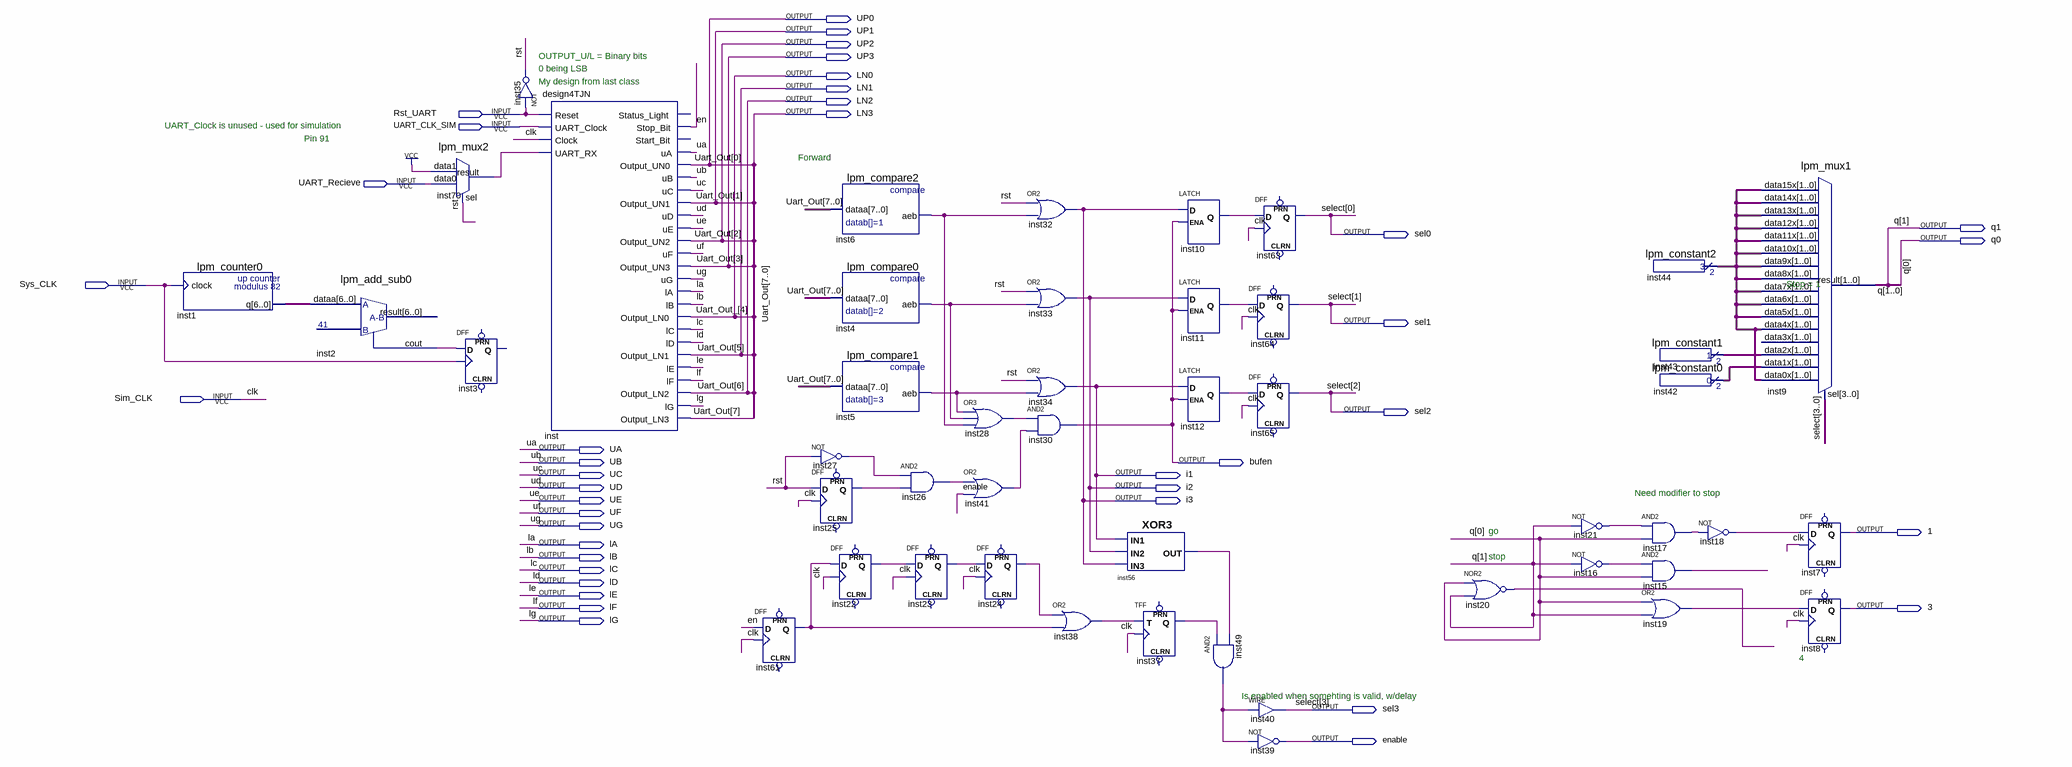
[diagram p0: schematic sheet]
// Quartus schematic project5.bdf as structural Verilog: 47 symbols, 40 pins
module project5 (
  input  Rst_UART,
  input  UART_CLK_SIM,
  input  UART_Recieve,
  input  Sys_CLK,
  input  Sim_CLK,
  output UP0,
  output UP1,
  output UP2,
  output UP3,
  output LN0,
  output LN1,
  output LN2,
  output LN3,
  output q1,
  output sel0,
  output q0,
  output sel1,
  output sel2,
  output UA,
  output UB,
  output bufen,
  output UC,
  output i1,
  output UD,
  output i2,
  output UE,
  output i3,
  output UF,
  output UG,
  output \1 ,
  output lA,
  output lB,
  output lC,
  output lD,
  output lE,
  output lF,
  output \3 ,
  output lG,
  output sel3,
  output enable
);

  wire en, inst2_cout, inst4_aeb, inst5_aeb, inst6_aeb, inst10_q, inst11_q, inst12_q, inst15_out, inst16_out,
       inst17_out, inst18_out, inst19_out, inst20_out, inst21_out, inst22_q, inst23_q, inst24_q, inst25_q,
       inst26_out, inst27_out, inst28_out, inst37_q, inst38_out, inst41_out, inst49_out, inst56_out,
       inst61_q, inst70_result, rst;
  wire [1:0] inst42_result, inst43_result, inst44_result;
  wire [6:0] inst1_q;
  wire [7:4] Uart_Out;

  lpm_counter0 inst1 (.clock(Sys_CLK), .q(inst1_q));
  lpm_add_sub0 inst2 (.dataa(inst1_q), .cout(inst2_cout));  // open: result
  lpm_mux2 inst70 (.data1(1'b1), .data0(UART_Recieve), .sel(rst), .result(inst70_result));
  DFF inst3 (.CLK(Sys_CLK), .D(inst2_cout));  // open: CLRN, PRN, Q
  not inst35 (rst, Rst_UART);
  design4TJN inst (
    .Reset(Rst_UART), .UART_Clock(UART_CLK_SIM), .Clock(Sim_CLK), .UART_RX(inst70_result), .Stop_Bit(en),
    .uA(UA), .Output_UN0(UP0), .uB(UB), .uC(UC), .Output_UN1(UP1), .uD(UD), .uE(UE), .Output_UN2(UP2),
    .uF(UF), .Output_UN3(UP3), .uG(UG), .lA(lA), .lB(lB), .Output_LN0(LN0), .lC(lC), .lD(lD),
    .Output_LN1(LN1), .lE(lE), .lF(lF), .Output_LN2(LN2), .lG(lG), .Output_LN3(Uart_Out[7]));  // open: Status_Light, Start_Bit
  DFF inst61 (.CLK(Sim_CLK), .D(en), .Q(inst61_q));  // open: CLRN, PRN
  not inst27 (inst27_out, rst);
  DFF inst25 (.CLK(Sim_CLK), .D(rst), .Q(inst25_q));  // open: CLRN, PRN
  lpm_compare2 inst6 (.dataa({Uart_Out[7], LN2, LN1, Uart_Out[4], UP3, UP2, UP1, UP0}), .aeb(inst6_aeb));
  lpm_compare0 inst4 (.dataa({Uart_Out[7], LN2, LN1, Uart_Out[4], UP3, UP2, UP1, UP0}), .aeb(inst4_aeb));
  lpm_compare1 inst5 (.dataa({Uart_Out[7], LN2, LN1, Uart_Out[4], UP3, UP2, UP1, UP0}), .aeb(inst5_aeb));
  DFF inst22 (.CLK(Sim_CLK), .D(inst61_q), .Q(inst22_q));  // open: CLRN, PRN
  and inst26 (inst26_out, inst27_out, inst25_q);
  DFF inst23 (.CLK(Sim_CLK), .D(inst22_q), .Q(inst23_q));  // open: CLRN, PRN
  or inst28 (inst28_out, inst5_aeb, inst4_aeb, inst6_aeb);
  or inst41 (inst41_out, inst26_out, enable);
  DFF inst24 (.CLK(Sim_CLK), .D(inst23_q), .Q(inst24_q));  // open: CLRN, PRN
  or inst32 (i3, rst, inst6_aeb);
  or inst33 (i2, rst, inst4_aeb);
  or inst34 (i1, rst, inst5_aeb);
  and inst30 (bufen, inst28_out, inst41_out);
  or inst38 (inst38_out, inst24_q, inst61_q);
  XOR3 inst56 (.IN3(i3), .IN1(i1), .IN2(i2), .OUT(inst56_out));
  TFF inst37 (.T(inst38_out), .CLK(Sim_CLK), .Q(inst37_q));  // open: PRN, CLRN
  LATCH inst10 (.D(i3), .ENA(bufen), .Q(inst10_q));
  LATCH inst11 (.D(i2), .ENA(bufen), .Q(inst11_q));
  LATCH inst12 (.D(i1), .ENA(bufen), .Q(inst12_q));
  and inst49 (inst49_out, inst37_q, inst56_out);
  DFF inst63 (.CLK(Sim_CLK), .D(inst10_q), .Q(sel0));  // open: CLRN, PRN
  DFF inst64 (.CLK(Sim_CLK), .D(inst11_q), .Q(sel1));  // open: CLRN, PRN
  DFF inst65 (.CLK(Sim_CLK), .D(inst12_q), .Q(sel2));  // open: CLRN, PRN
  assign sel3 = inst49_out;  // WIRE inst40
  not inst39 (enable, inst49_out);
  nor inst20 (inst20_out, q0, q1);
  not inst21 (inst21_out, q1);
  not inst16 (inst16_out, q1);
  lpm_constant2 inst44 (.result(inst44_result));
  lpm_constant1 inst43 (.result(inst43_result));
  lpm_constant0 inst42 (.result(inst42_result));
  and inst17 (inst17_out, inst21_out, q0);
  and inst15 (inst15_out, inst16_out, q0);
  or inst19 (inst19_out, q0, q1);
  not inst18 (inst18_out, inst17_out);
  lpm_mux1 inst9 (
    .data15x(inst44_result), .data14x(inst44_result), .data13x(inst44_result), .data12x(inst44_result),
    .data11x(inst44_result), .data10x(inst44_result), .data9x(inst44_result), .data8x(inst44_result),
    .data7x(inst44_result), .data6x(inst44_result), .data5x(inst44_result), .data4x(inst44_result),
    .data2x(inst43_result), .data1x(inst42_result), .data0x(inst44_result), .sel({sel3, sel2, sel1, sel0}),
    .result({q1, q0}));  // open: data3x
  DFF inst7 (.CLK(Sim_CLK), .D(inst18_out), .Q(\1 ));  // open: CLRN, PRN
  DFF inst8 (.CLK(Sim_CLK), .D(inst19_out), .Q(\3 ));  // open: CLRN, PRN

  // Other names for the same wires on the sheet: clk = Sim_CLK; select[3:0] = {sel3, sel2, sel1, sel0};
  //   Uart_Out (some bits) = {LN2, LN1, UP3, UP2, UP1, UP0}; Uart_Out_[4] = LN0

  // Notes on the sheet:
  //   OUTPUT_U/L = Binary bits
  //   0 being LSB
  //   My design from last class
  //   UART_Clock is unused - used for simulation
  //   Pin 91
  //   Forward
  //   Stop = 1
  //   Need modifier to stop
  //   go
  //   stop
  //   4
  //   Is enabled when somehting is valid, w/delay
endmodule
